# EAGLE schematic Aegis PCB - 2 v35 (EAGLE 9.7.0)

## Sheet 1 of 4: Board Conn
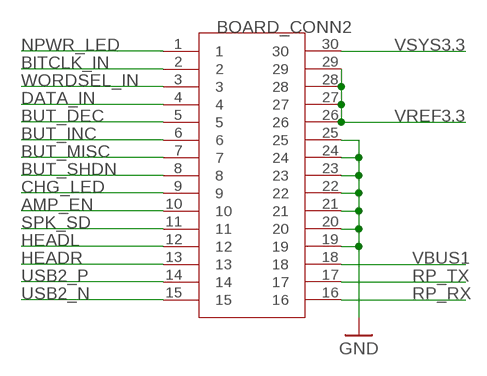
[diagram p0: schematic, sheet 1]

### Parts
BOARD_CONN2  CONN-AXK6F30347YG  [CONN-AXK6F30347YG]

### Nets
AMP_EN: BOARD_CONN2.10 ; also sheet 3
BITCLK_IN: BOARD_CONN2.2 ; also sheet 3
BUT_DEC: BOARD_CONN2.5 ; also sheet 4
BUT_INC: BOARD_CONN2.6 ; also sheet 4
BUT_MISC: BOARD_CONN2.7 ; also sheet 4
BUT_SHDN: BOARD_CONN2.8 ; also sheet 4
CHG_LED: BOARD_CONN2.9 ; also sheet 4
DATA_IN: BOARD_CONN2.4 ; also sheet 3
GND: BOARD_CONN2.19 BOARD_CONN2.20 BOARD_CONN2.21 BOARD_CONN2.22 BOARD_CONN2.23 BOARD_CONN2.24 BOARD_CONN2.25 ; also sheet 2,3,4
HEADL: BOARD_CONN2.12 ; also sheet 3
HEADR: BOARD_CONN2.13 ; also sheet 3
NPWR_LED: BOARD_CONN2.1 ; also sheet 2
RP_RX: BOARD_CONN2.16 ; also sheet 2
RP_TX: BOARD_CONN2.17 ; also sheet 2
SPK_SD: BOARD_CONN2.11 ; also sheet 3
USB2_N: BOARD_CONN2.15 ; also sheet 2
USB2_P: BOARD_CONN2.14 ; also sheet 2
VBUS1: BOARD_CONN2.18 ; also sheet 2
VREF3.3: BOARD_CONN2.26 BOARD_CONN2.27 BOARD_CONN2.28 BOARD_CONN2.29 ; also sheet 2,3
VSYS3.3: BOARD_CONN2.30 ; also sheet 4
WORDSEL_IN: BOARD_CONN2.3 ; also sheet 3

## Sheet 2 of 4: Controller
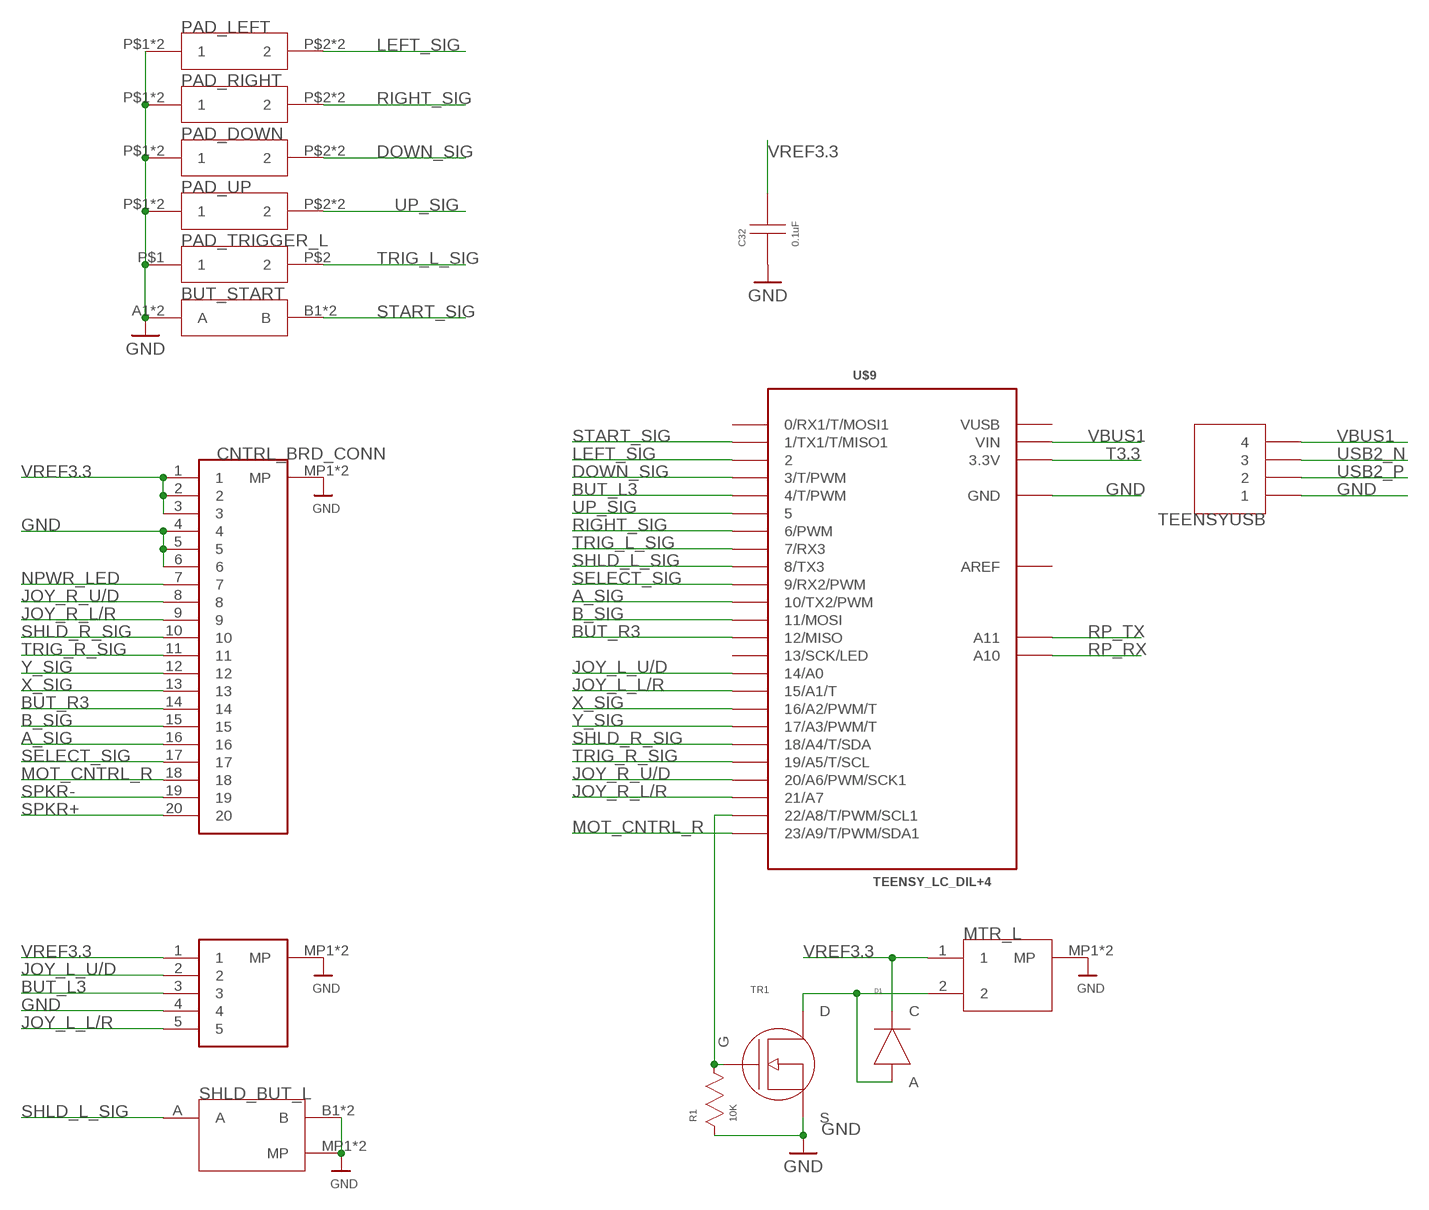
[diagram p1: schematic, sheet 2]

### Parts
BUT_START  BUT-R-667834  [BUT-R-667834]
C32  0.1uF  CAP-603  [CAP-603]
CNTRL_BRD_CONN  CONN-0527462033  [CONN-0527462033]
D1  DIODE-X3-WLB1608-2  [DIODE-X3-WLB1608-2]
JOYSTICK_L  CONN-046809605110846+  [CONN-046809605110846+]
MTR_L  CONN-0781710002  [CONN-0781710002]
PAD_DOWN  AEGIS-BUTTONPAD  [AEGIS-BUTTONPAD]
PAD_LEFT  AEGIS-BUTTONPAD  [AEGIS-BUTTONPAD]
PAD_RIGHT  AEGIS-BUTTONPAD  [AEGIS-BUTTONPAD]
PAD_TRIGGER_L  AEGIN-SHLDPAD  [AEGIN-SHLDPAD]
PAD_UP  AEGIS-BUTTONPAD  [AEGIS-BUTTONPAD]
R1  10K  RES-603  [RES-603]
SHLD_BUT_L  AEGIN-SHLDBUT  [AEGIN-SHLDBUT]
TEENSYUSB  CONN_4PIN  [CONN_4PIN]
TR1  TRAN-DMG2302UKQ  [TRAN-DMG2302UKQ]
U$9  TEENSY_LC_DIL+4  [TEENSY_3.0-3.2&LC_DIL+4]

### Nets
A_SIG: CNTRL_BRD_CONN.16 U$9.10(10/TX2/PWM)
B_SIG: CNTRL_BRD_CONN.15 U$9.11(11/MOSI)
BUT_L3: JOYSTICK_L.3 U$9.4(4/T/PWM)
BUT_R3: CNTRL_BRD_CONN.14 U$9.12(12/MISO)
DOWN_SIG: PAD_DOWN.P$2 PAD_DOWN.P$4 U$9.3(3/T/PWM)
GND: BUT_START.A1(A) BUT_START.A2(A) C32.A CNTRL_BRD_CONN.4 CNTRL_BRD_CONN.5 CNTRL_BRD_CONN.6 CNTRL_BRD_CONN.MP1(MP) CNTRL_BRD_CONN.MP2(MP) JOYSTICK_L.4 JOYSTICK_L.MP1(MP) JOYSTICK_L.MP2(MP) MTR_L.MP1(MP) MTR_L.MP2(MP) PAD_DOWN.P$1 PAD_DOWN.P$3 PAD_LEFT.P$1 PAD_LEFT.P$3 PAD_RIGHT.P$1 PAD_RIGHT.P$3 PAD_TRIGGER_L.P$1 PAD_UP.P$1 PAD_UP.P$3 R1.A SHLD_BUT_L.B1(B) SHLD_BUT_L.B2(B) SHLD_BUT_L.MP1(MP) SHLD_BUT_L.MP2(MP) TEENSYUSB.1 TR1.S U$9.AGND(GND) U$9.GND ; also sheet 1,3,4
JOY_L_L/R: JOYSTICK_L.5 U$9.15/A1(15/A1/T)
JOY_L_U/D: JOYSTICK_L.2 U$9.14/A0
JOY_R_L/R: CNTRL_BRD_CONN.9 U$9.21/A7
JOY_R_U/D: CNTRL_BRD_CONN.8 U$9.20/A6(20/A6/PWM/SCK1)
LEFT_SIG: PAD_LEFT.P$2 PAD_LEFT.P$4 U$9.2
MOT_CNTRL_R: CNTRL_BRD_CONN.18 U$9.23/A9(23/A9/T/PWM/SDA1)
N$1: R1.C TR1.G U$9.22/A8(22/A8/T/PWM/SCL1)
N$8: D1.A MTR_L.2 TR1.D
NPWR_LED: CNTRL_BRD_CONN.7 ; also sheet 1
RIGHT_SIG: PAD_RIGHT.P$2 PAD_RIGHT.P$4 U$9.6(6/PWM)
RP_RX: U$9.A10 ; also sheet 1
RP_TX: U$9.A11 ; also sheet 1
SELECT_SIG: CNTRL_BRD_CONN.17 U$9.9(9/RX2/PWM)
SHLD_L_SIG: SHLD_BUT_L.A U$9.8(8/TX3)
SHLD_R_SIG: CNTRL_BRD_CONN.10 U$9.18/A4(18/A4/T/SDA)
SPKR+: CNTRL_BRD_CONN.20 ; also sheet 3
SPKR-: CNTRL_BRD_CONN.19 ; also sheet 3
START_SIG: BUT_START.B1(B) BUT_START.B2(B) U$9.1(1/TX1/T/MISO1)
T3.3: U$9.3.3V
TRIG_L_SIG: PAD_TRIGGER_L.P$2 U$9.7(7/RX3)
TRIG_R_SIG: CNTRL_BRD_CONN.11 U$9.19/A5(19/A5/T/SCL)
UP_SIG: PAD_UP.P$2 PAD_UP.P$4 U$9.5
USB2_N: TEENSYUSB.3 ; also sheet 1
USB2_P: TEENSYUSB.2 ; also sheet 1
VBUS1: TEENSYUSB.4 U$9.VIN ; also sheet 1
VREF3.3: C32.C CNTRL_BRD_CONN.1 CNTRL_BRD_CONN.2 CNTRL_BRD_CONN.3 D1.C JOYSTICK_L.1 MTR_L.1 ; also sheet 1,3
X_SIG: CNTRL_BRD_CONN.13 U$9.16/A2(16/A2/PWM/T)
Y_SIG: CNTRL_BRD_CONN.12 U$9.17/A3(17/A3/PWM/T)
Unconnected: U$9.0(0/RX1/T/MOSI1) U$9.13(13/SCK/LED)

## Sheet 3 of 4: Audio
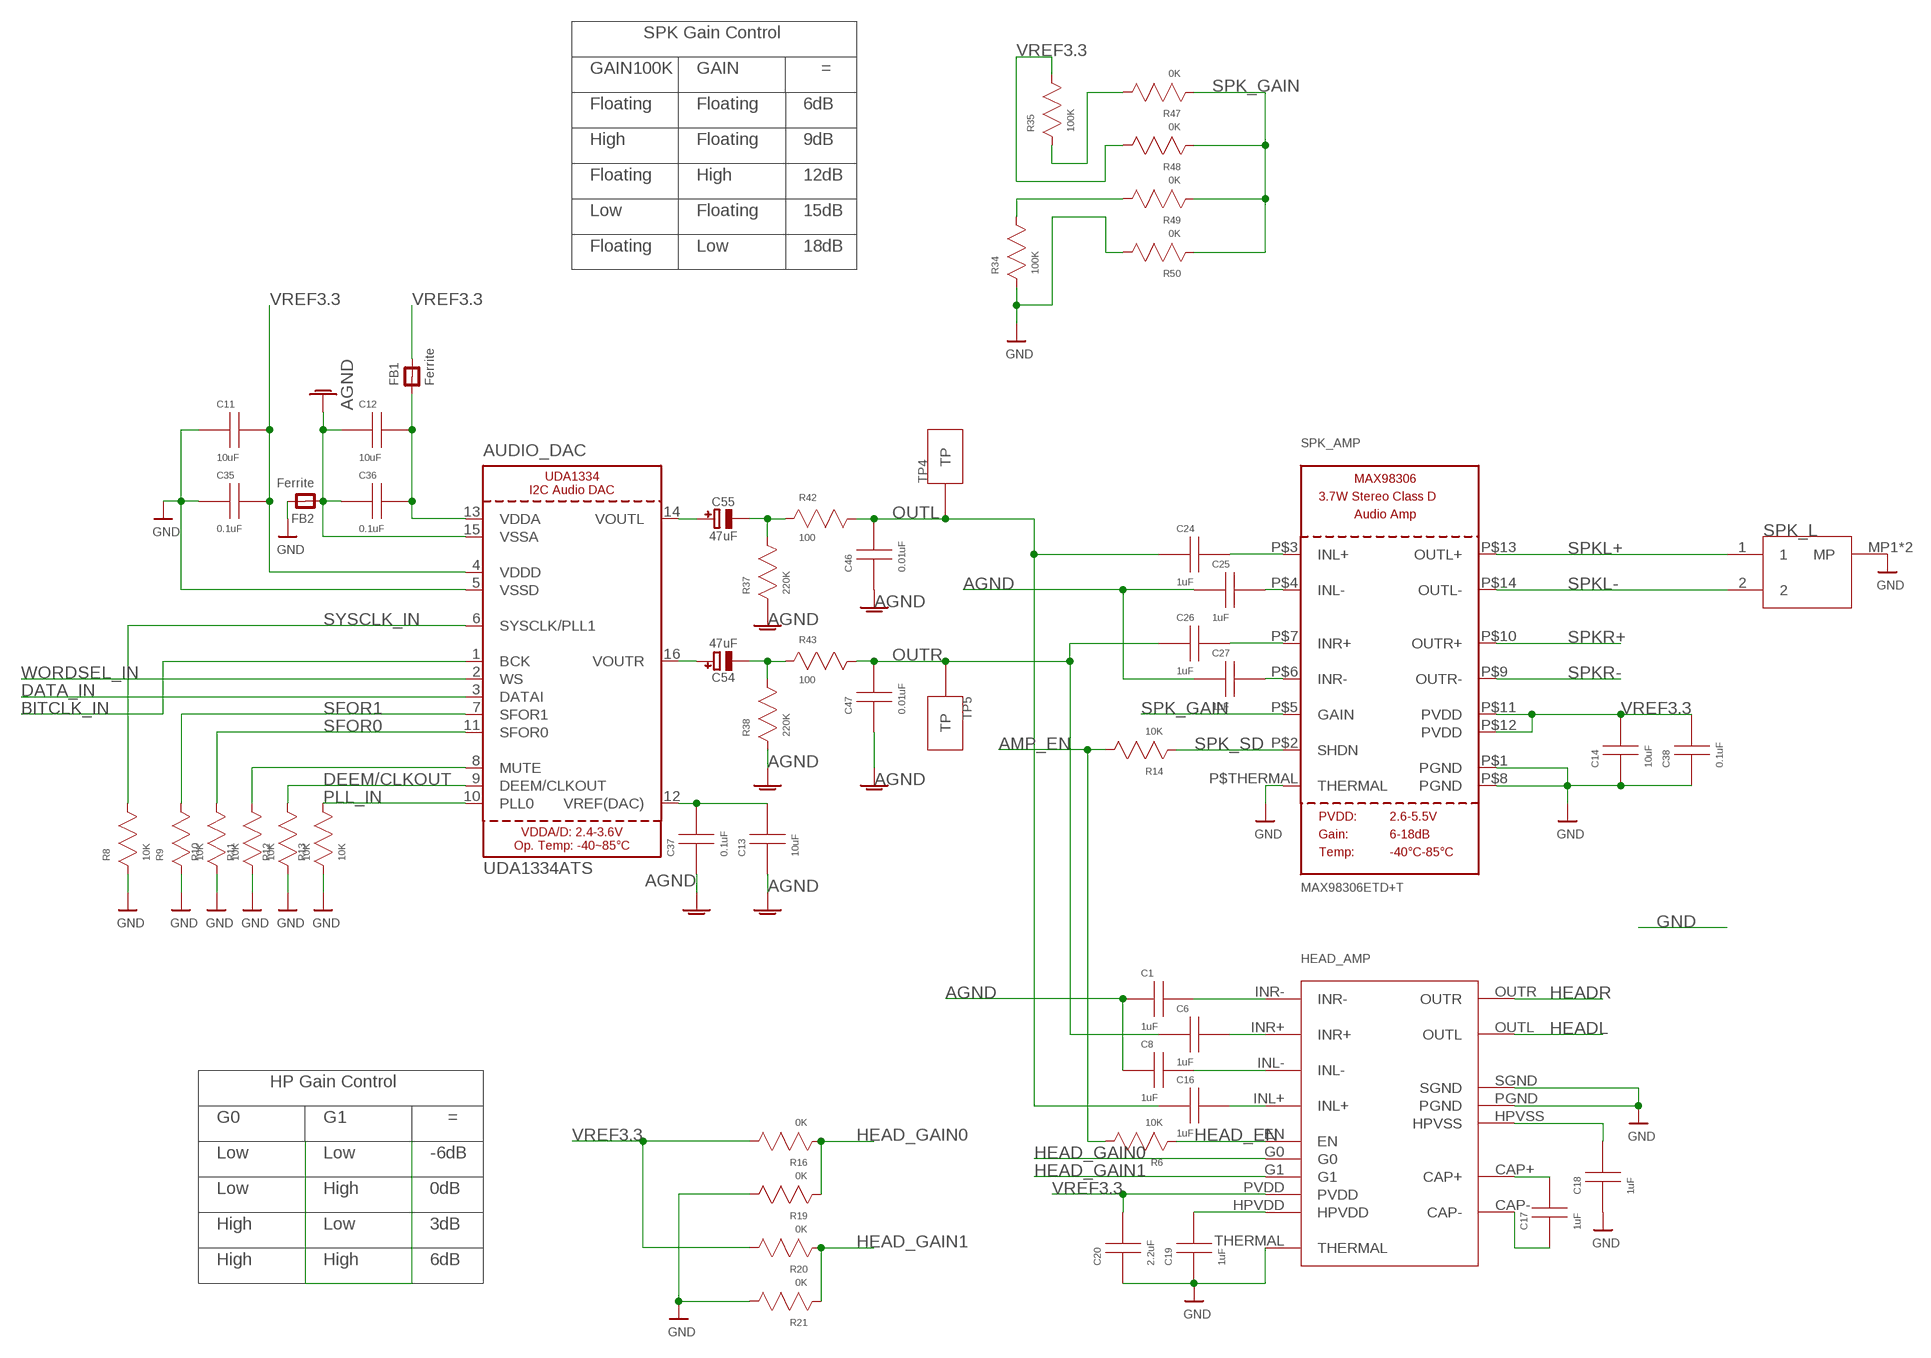
[diagram p2: schematic, sheet 3]

### Parts
AUDIO_DAC  UDA1334ATS  AUDIO_I2S_UDA1334""  [SSOP16_4.4MM]
C1  1uF  CAP-603  [CAP-603]
C6  1uF  CAP-603  [CAP-603]
C8  1uF  CAP-603  [CAP-603]
C11  10uF  CAP-603  [CAP-603]
C12  10uF  CAP-603  [CAP-603]
C13  10uF  CAP-603  [CAP-603]
C14  10uF  CAP-603  [CAP-603]
C16  1uF  CAP-603  [CAP-603]
C17  1uF  CAP-603  [CAP-603]
C18  1uF  CAP-603  [CAP-603]
C19  1uF  CAP-603  [CAP-603]
C20  2.2uF  CAP-603  [CAP-603]
C24  1uF  CAP-603  [CAP-603]
C25  1uF  CAP-603  [CAP-603]
C26  1uF  CAP-603  [CAP-603]
C27  1uF  CAP-603  [CAP-603]
C35  0.1uF  CAP-603  [CAP-603]
C36  0.1uF  CAP-603  [CAP-603]
C37  0.1uF  CAP-603  [CAP-603]
C38  0.1uF  CAP-603  [CAP-603]
C46  0.01uF  CAP-603  [CAP-603]
C47  0.01uF  CAP-603  [CAP-603]
C54  47uF  CAP_ELECTROLYTICPANASONIC_C  [PANASONIC_C]
C55  47uF  CAP_ELECTROLYTICPANASONIC_C  [PANASONIC_C]
FB1  Ferrite  FERRITE0805  [0805@1]
FB2  Ferrite  FERRITE0805  [0805@1]
HEAD_AMP  IC-PAM8908  [IC-PAM8908]
R6  10K  RES-603  [RES-603]
R8  10K  RES-603  [RES-603]
R9  10K  RES-603  [RES-603]
R10  10K  RES-603  [RES-603]
R11  10K  RES-603  [RES-603]
R12  10K  RES-603  [RES-603]
R13  10K  RES-603  [RES-603]
R14  10K  RES-603  [RES-603]
R16  0K  RES-603  [RES-603]
R19  0K  RES-603  [RES-603]
R20  0K  RES-603  [RES-603]
R21  0K  RES-603  [RES-603]
R34  100K  RES-603  [RES-603]
R35  100K  RES-603  [RES-603]
R37  220K  RES-603  [RES-603]
R38  220K  RES-603  [RES-603]
R42  100  RES-603  [RES-603]
R43  100  RES-603  [RES-603]
R47  0K  RES-603  [RES-603]
R48  0K  RES-603  [RES-603]
R49  0K  RES-603  [RES-603]
R50  0K  RES-603  [RES-603]
SPK_AMP  MAX98306ETD+T  AUDIOAMP_MAX98306  [TDFN14_3X3MM]
SPK_L  CONN-0781710002  [CONN-0781710002]
TP4  TESTPOINT  [TESTPOINT]
TP5  TESTPOINT  [TESTPOINT]

### Nets
AGND: AUDIO_DAC.15(VSSA) C1.A C8.A C12.A C13.A C25.A C27.A C36.A C37.A C46.A C47.A FB2.1 R37.A R38.A
AMP_EN: R6.C R14.C ; also sheet 1
BITCLK_IN: AUDIO_DAC.1(BCK) ; also sheet 1
DATA_IN: AUDIO_DAC.3(DATAI) ; also sheet 1
DEEM/CLKOUT: AUDIO_DAC.9(DEEM/CLKOUT) R12.C
GND: AUDIO_DAC.5(VSSD) C11.A C14.A C18.A C19.A C20.A C35.A C38.A FB2.2 HEAD_AMP.PGND HEAD_AMP.SGND HEAD_AMP.THERMAL R8.A R9.A R10.A R11.A R12.A R13.A R19.C R21.C R34.A R50.C SPK_AMP.P$1(PGND) SPK_AMP.P$8(PGND) SPK_AMP.P$THERMAL(THERMAL) SPK_L.MP1(MP) SPK_L.MP2(MP) ; also sheet 1,2,4
HEAD_EN: HEAD_AMP.EN R6.A
HEAD_GAIN0: HEAD_AMP.G0 R16.A R19.A
HEAD_GAIN1: HEAD_AMP.G1 R20.A R21.A
HEADL: HEAD_AMP.OUTL ; also sheet 1
HEADR: HEAD_AMP.OUTR ; also sheet 1
N$2: AUDIO_DAC.8(MUTE) R11.C
N$3: AUDIO_DAC.13(VDDA) C12.C C36.C FB1.1
N$5: C54.- R38.C R43.A
N$7: C55.- R37.C R42.A
N$9: C1.C HEAD_AMP.INR-
N$10: AUDIO_DAC.12(VREF(DAC)) C13.C C37.C
N$12: AUDIO_DAC.16(VOUTR) C54.+
N$13: AUDIO_DAC.14(VOUTL) C55.+
N$14: R35.A R47.C
N$15: R34.C R49.C
N$16: C24.C SPK_AMP.P$3(INL+)
N$17: C25.C SPK_AMP.P$4(INL-)
N$18: C26.C SPK_AMP.P$7(INR+)
N$19: C27.C SPK_AMP.P$6(INR-)
N$21: C6.C HEAD_AMP.INR+
N$22: C16.C HEAD_AMP.INL+
N$23: C8.C HEAD_AMP.INL-
N$24: C17.C HEAD_AMP.CAP+
N$28: C17.A HEAD_AMP.CAP-
N$29: C18.C HEAD_AMP.HPVSS
N$30: C19.C HEAD_AMP.HPVDD
OUTL: C16.A C24.A C46.C R42.C TP4.TP
OUTR: C6.A C26.A C47.C R43.C TP5.TP
PLL_IN: AUDIO_DAC.10(PLL0) R13.C
SFOR0: AUDIO_DAC.11(SFOR0) R10.C
SFOR1: AUDIO_DAC.7(SFOR1) R9.C
SPK_GAIN: R47.A R48.A R49.A R50.A SPK_AMP.P$5(GAIN)
SPK_SD: R14.A SPK_AMP.P$2(SHDN) ; also sheet 1
SPKL+: SPK_AMP.P$13(OUTL+) SPK_L.1
SPKL-: SPK_AMP.P$14(OUTL-) SPK_L.2
SPKR+: SPK_AMP.P$10(OUTR+) ; also sheet 2
SPKR-: SPK_AMP.P$9(OUTR-) ; also sheet 2
SYSCLK_IN: AUDIO_DAC.6(SYSCLK/PLL1) R8.C
VREF3.3: AUDIO_DAC.4(VDDD) C11.C C14.C C20.C C35.C C38.C FB1.2 HEAD_AMP.PVDD R16.C R20.C R35.C R48.C SPK_AMP.P$11(PVDD) SPK_AMP.P$12(PVDD) ; also sheet 1,2
WORDSEL_IN: AUDIO_DAC.2(WS) ; also sheet 1

### Notes on the sheet
- SPK Gain Control
- GAIN100K | GAIN | =
- Floating | Floating | 6dB
- High | Floating | 9dB
- Floating | High | 12dB
- Low | Floating | 15dB
- Floating | Low | 18dB
- HP Gain Control
- G0 | G1 | =
- Low | Low | -6dB
- Low | High | 0dB
- High | Low | 3dB
- High | High | 6dB

## Sheet 4 of 4: Button/LED
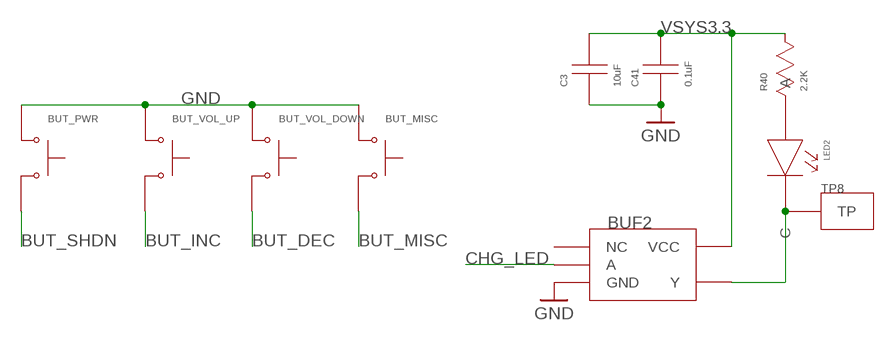
[diagram p3: schematic, sheet 4]

### Parts
BUF2  BUF-74LVC1G07  [BUF-74LVC1G07]
BUT_MISC  BUT-KSS331GLFS  [BUT-KSS331GLFS]
BUT_PWR  BUT-KSS331GLFS  [BUT-KSS331GLFS]
BUT_VOL_DOWN  BUT-KSS331GLFS  [BUT-KSS331GLFS]
BUT_VOL_UP  BUT-KSS331GLFS  [BUT-KSS331GLFS]
C3  10uF  CAP-603  [CAP-603]
C41  0.1uF  CAP-603  [CAP-603]
LED2  LED-SM0805UWC  [LED-SM0805UWC]
R40  2.2K  RES-603  [RES-603]
TP8  TESTPOINT  [TESTPOINT]

### Nets
BUT_DEC: BUT_VOL_DOWN.2 ; also sheet 1
BUT_INC: BUT_VOL_UP.2 ; also sheet 1
BUT_MISC: BUT_MISC.2 ; also sheet 1
BUT_SHDN: BUT_PWR.2 ; also sheet 1
CHG_LED: BUF2.A ; also sheet 1
GND: BUF2.GND BUT_MISC.1 BUT_PWR.1 BUT_VOL_DOWN.1 BUT_VOL_UP.1 C3.A C41.A ; also sheet 1,2,3
N$50: LED2.A R40.A
N$51: BUF2.Y LED2.C TP8.TP
VSYS3.3: BUF2.VCC C3.C C41.C R40.C ; also sheet 1
Unconnected: BUF2.NC

## Power pins joined to a net without a drawn wire
AREF: U$9.AREF
VUSB: U$9.VUSB

## Library data of the parts
AUDIO_DAC = microbuilder:AUDIO_I2S_UDA1334: UDA1334 I2C Audio DAC Power Supply: 2.4-3.6V Sample frequencies from 16-100kHz
BOARD_CONN2 = Personal:CONN-AXK6F30347YG
BUF2 = Personal:BUF-74LVC1G07
BUT_MISC BUT_PWR BUT_VOL_DOWN BUT_VOL_UP = Personal:BUT-KSS331GLFS
BUT_START = Personal:BUT-R-667834
C1 C3 C6 C8 C11-C14 C16-C20 C24-C27 C32 C35-C38 C41 C46 C47 = Personal:CAP-603
C54 C55 = microbuilder:CAP_ELECTROLYTIC: Electrolytic Capacitors SMT PANASONIC_C - Size C Panasonic Electrolytic Aluminum Capacitor 47µF 16V 20% Electrolytic Capacitor [Digikey: PCE3890TR-ND] PANASONIC_D - Size D Panasonic Electrolytic Aluminum Capacitor 100µF 25V 20% Electrolytic Capacitor [Digikey: PCE3898TR-ND] PTH 3.5 mm grid, 8 mm diameter ... 3.5 mm grid, 10 mm diameter ...
CNTRL_BRD_CONN = Personal:CONN-0527462033
D1 = Personal:DIODE-X3-WLB1608-2
FB1 FB2 = microbuilder:FERRITE: Ferrite Bead 0603 MMZ1608B121C - 120 Ohm @ 100MHz, 600mA, 0.15 Ohm DC Resistance - Digikey: 445-2164-1-ND BK1608HW121-T - 120 Ohm, 600mA Ferrite Chip - Digikey: 587-1876-2-ND 0805 HZ0805B272R-10 - 2.7K Ohm @ 100MHz, 200mA, 0.8 Ohm DC Resistance - Digikey: 240-2504-1-ND (see also Murata BLM21BD272SN1L) MMZ2012Y152B - 1.5K Ohm @ 100MHz, 500mA, 0.4 Ohm DC Resistance - Digikey: 445-1560-1-ND - Mainly for high frequency (80-400MHz) MMZ2012R102A - 1K Ohm @ 100MHz, 500mA, 0.3 Ohm DC Resistance - Digikey: 445-1555-2-ND - More general purpose (10-200MHz)
HEAD_AMP = Personal:IC-PAM8908
JOYSTICK_L = Personal:CONN-046809605110846+
LED2 = Personal:LED-SM0805UWC
MTR_L SPK_L = Personal:CONN-0781710002
PAD_DOWN PAD_LEFT PAD_RIGHT PAD_UP = Personal:AEGIS-BUTTONPAD
PAD_TRIGGER_L = Personal:AEGIN-SHLDPAD
R1 R6 R8-R14 R16 R19-R21 R34 R35 R37 R38 R40 R42 R43 R47-R50 = Personal:RES-603
SHLD_BUT_L = Personal:AEGIN-SHLDBUT
SPK_AMP = microbuilder:AUDIOAMP_MAX98306: MAX98306 3.7W Stereo Audio Amp - TDFN14 3.7W @ 3 ohm, 2.6-5.5V supply, 6-18dB selectable gain
TEENSYUSB = Personal:CONN_4PIN
TP4 TP5 TP8 = Personal:TESTPOINT
TR1 = Personal:TRAN-DMG2302UKQ
U$9 = Teensy_3_and_LC_Series_Boards_v1.4:TEENSY_LC_DIL+4: DIL package with 4 pins on the inside broken out.

## Net classes
1 PWR 1A: width 0.254 mm